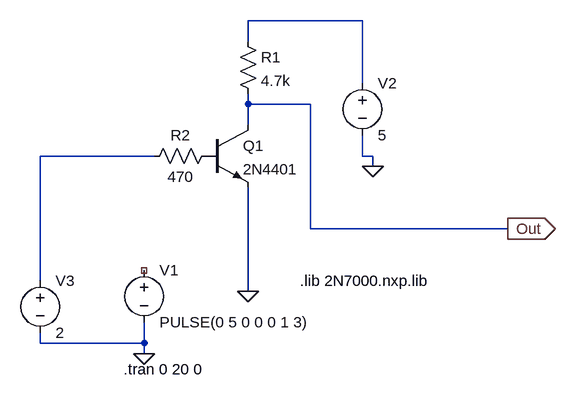
[diagram p0: schematic BJT.asc]
BJT.asc, the LTspice schematic file:
Version 4
SHEET 1 880 680
WIRE 320 -160 144 -160
WIRE 144 -128 144 -160
WIRE 320 -64 320 -160
WIRE 144 -32 144 -48
WIRE 240 -32 144 -32
WIRE 144 0 144 -32
WIRE 0 48 -176 48
WIRE 320 48 320 16
WIRE 336 48 320 48
WIRE 336 64 336 48
WIRE 240 160 240 -32
WIRE 544 160 240 160
WIRE -176 240 -176 48
WIRE 144 256 144 96
WIRE -176 336 -176 320
WIRE -16 336 -16 304
WIRE -16 336 -176 336
WIRE -16 352 -16 336
FLAG -16 352 0
FLAG 144 256 0
FLAG 336 64 0
FLAG 544 160 Out
IOPIN 544 160 Out
SYMBOL voltage -16 208 R0
WINDOW 123 0 0 Left 0
WINDOW 39 0 0 Left 0
SYMATTR InstName V1
SYMATTR Value PULSE(0 5 0 0 0 1 3)
SYMBOL voltage 320 -80 R0
WINDOW 123 0 0 Left 0
WINDOW 39 0 0 Left 0
SYMATTR InstName V2
SYMATTR Value 5
SYMBOL res 128 -144 R0
SYMATTR InstName R1
SYMATTR Value 4.7k
SYMBOL voltage -176 224 R0
WINDOW 123 0 0 Left 0
WINDOW 39 0 0 Left 0
SYMATTR InstName V3
SYMATTR Value 2
SYMBOL res 96 32 R90
WINDOW 0 0 56 VBottom 2
WINDOW 3 32 56 VTop 2
SYMATTR InstName R2
SYMATTR Value 470
SYMBOL npn 80 0 R0
SYMATTR InstName Q1
SYMATTR Value 2N4401
TEXT 224 240 Left 2 !.lib 2N7000.nxp.lib
TEXT -48 376 Left 2 !.tran 0 20 0

The netlist it stands for:
* BJT.asc
V1 NC_01 0 PULSE(0 5 0 0 0 1 3)
V2 N001 0 5
R1 N001 Out 4.7k
V3 N002 0 2
R2 P001 N002 470
Q1 Out P001 0 0 2N4401
.model NPN NPN
.model PNP PNP
.lib standard.bjt
.lib 2N7000.nxp.lib
.tran 0 20 0
.backanno
.end